# EAGLE schematic sandbox_v0.4 (EAGLE 6.3)

## Sheet 1 of 3
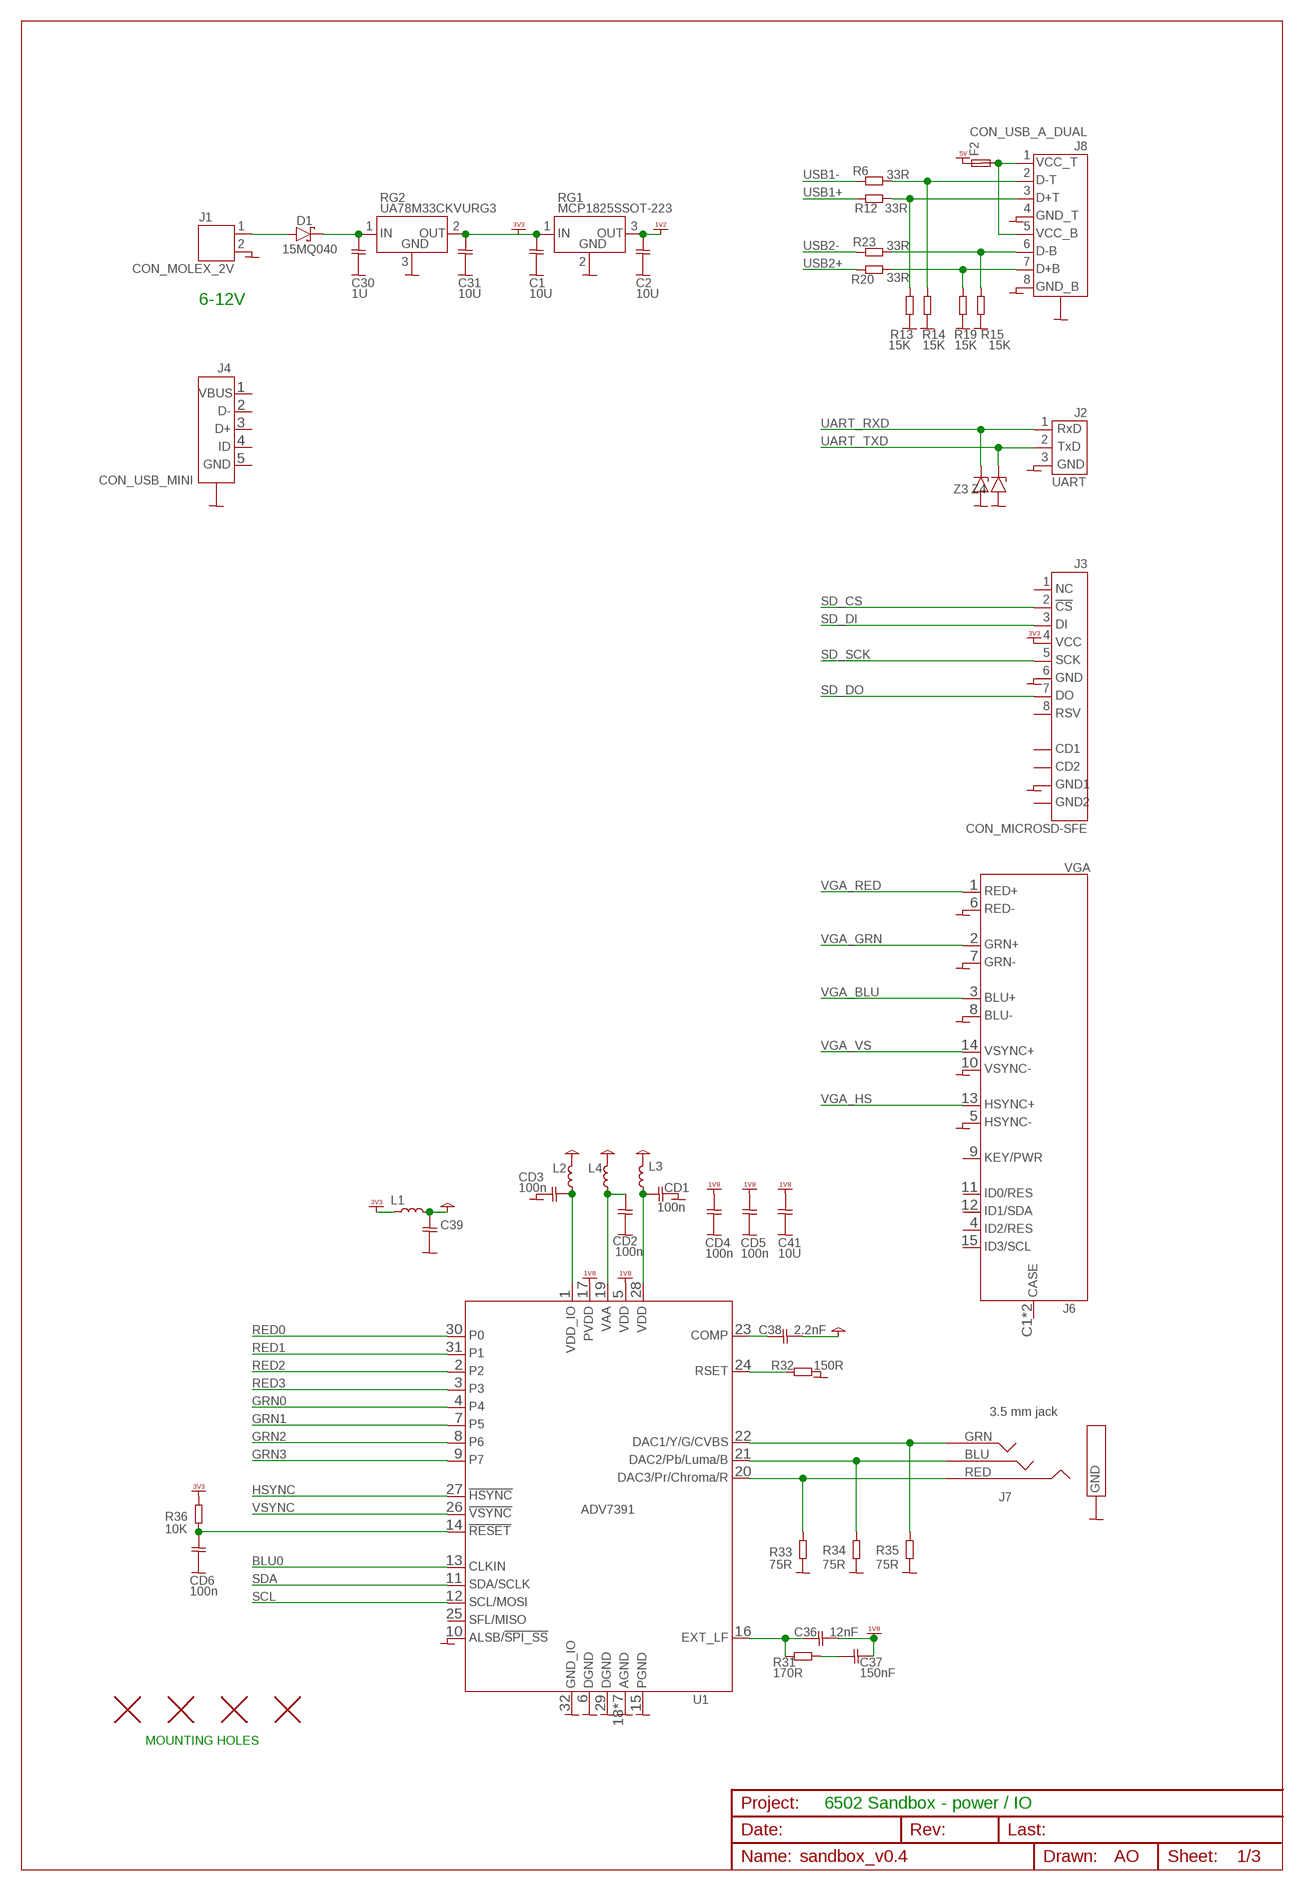
[diagram p0: schematic, sheet 1]

### Parts
C1  10U  CAP0603  [CAP0603]
C2  10U  CAP0603  [CAP0603]
C30  1U  CAP0603  [CAP0603]
C31  10U  CAP0603  [CAP0603]
C36  12nF  CAP0402-SMALL  [0402-SMALL]
C37  150nF  CAP0402-SMALL  [0402-SMALL]
C38  2.2nF  CAP0402-SMALL  [0402-SMALL]
C39  CAP0603  [CAP0603]
C41  10U  CAP0603  [CAP0603]
CD1  100n  CAP0402-SMALL  [0402-SMALL]
CD2  100n  CAP0402-SMALL  [0402-SMALL]
CD3  100n  CAP0402-SMALL  [0402-SMALL]
CD4  100n  CAP0402-SMALL  [0402-SMALL]
CD5  100n  CAP0402-SMALL  [0402-SMALL]
CD6  100n  CAP0402-SMALL  [0402-SMALL]
D1  15MQ040  DIODE_15MQ040  [DIODE_SMA]
F2  POLYFUSE1210  [POLYFUSE1210]
H1  HOLE_NPTH_3.2MM  [HOLE_NPTH_3.2MM]
H2  HOLE_NPTH_3.2MM  [HOLE_NPTH_3.2MM]
H3  HOLE_NPTH_3.2MM  [HOLE_NPTH_3.2MM]
H4  HOLE_NPTH_3.2MM  [HOLE_NPTH_3.2MM]
J1  CON_MOLEX_2V  [CON_MOLEX_2V]
J2  UART  CON_MOLEX_3V_RS232  [CON_MOLEX_3V]
J3  CON_MICROSD-SFE  [CON_USD-SOCKET-PP]
J4  CON_USB_MINI  [CON_USB-B_MINI]
J6  CON-VGA  [VGA]
J7  JACK_3.5MM_LUMBERG  [JACK_3.5MM_LUMBERG]
J8  CON_USB_A_DUAL  [USB_SOCKET_2XA]
L1  BEAD0603  [RES0603]
L2  BEAD0402-SMALL  [0402-SMALL]
L3  BEAD0402-SMALL  [0402-SMALL]
L4  BEAD0402-SMALL  [0402-SMALL]
R6  33R  RES0603  [RES0603]
R12  33R  RES0603  [RES0603]
R13  15K  RES0603  [RES0603]
R14  15K  RES0603  [RES0603]
R15  15K  RES0603  [RES0603]
R19  15K  RES0603  [RES0603]
R20  33R  RES0603  [RES0603]
R23  33R  RES0603  [RES0603]
R31  170R  RES0402-SMALL  [0402-SMALL]
R32  150R  RES0402-SMALL  [0402-SMALL]
R33  75R  RES0402-SMALL  [0402-SMALL]
R34  75R  RES0402-SMALL  [0402-SMALL]
R35  75R  RES0402-SMALL  [0402-SMALL]
R36  10K  RES0402-SMALL  [0402-SMALL]
RG1  MCP1825SSOT-223  [SOT-223]
RG2  UA78M33CKVURG3  [TO252]
U1  ADV7391  [CP_32_2]
Z3  ZENER_SOD80  [ZENER_SOD80]
Z4  ZENER_SOD80  [ZENER_SOD80]

### Nets
BLU0: U1.13(CLKIN) ; also sheet 3
BLUE: J7.3(BLU) R34.2 U1.21(DAC2/PB/LUMA/B)
GND: C1.2 C2.2 C30.2 C31.2 C39.2 C41.2 CD1.2 CD2.2 CD3.2 CD4.2 CD5.2 CD6.2 J1.2 J2.3 J3.6(6GND) J3.GND1(SHIELD) J4.CASE1(CASE) J4.CASE2(CASE) J4.CASE3(CASE) J4.CASE4(CASE) J6.5(HSYNC-) J6.6(RED-) J6.7(GRN-) J6.8(BLU-) J6.10(VSYNC-) J7.1(GND) J8.P4A(8.GND_B) J8.P4B(4.GND_T) J8.PC1(5.CASE) J8.PC2(5.CASE) J8.PC3(5.CASE) J8.PC4(5.CASE) R13.1 R14.1 R15.1 R19.1 R32.2 R33.1 R34.1 R35.1 RG1.2(2.GND) RG1.4(2.GND) RG2.3(3.GND) U1.6(DGND) U1.10(ALSB/!SPI_SS) U1.15(PGND) U1.18(AGND) U1.29(DGND) U1.32(GND_IO) U1.33(AGND) U1.34(AGND) U1.35(AGND) U1.36(AGND) U1.37(AGND) U1.38(AGND) Z3.1(+) Z4.1(+) ; also sheet 2,3
GREEN: J7.4A(GRN) J7.4B(GRN) R35.2 U1.22(DAC1/Y/G/CVBS)
GRN0: U1.4 ; also sheet 3
GRN1: U1.7(P5) ; also sheet 3
GRN2: U1.8(P6) ; also sheet 3
GRN3: U1.9(P7) ; also sheet 3
HSYNC: U1.27(!HSYNC) ; also sheet 3
N$1: C36.1 R31.1 U1.16(EXT_LF)
N$2: D1.A(+) J1.1
N$3: C30.1 D1.C(-) RG2.1(1.IN)
N$9: J8.P2B(2.D-T) R6.2 R14.2
N$10: C37.1 R31.2
N$11: C38.1 U1.23(COMP)
N$12: R32.1 U1.24(RSET)
N$13: CD2.1 L4.2 U1.19(VAA)
N$14: CD6.1 R36.1 U1.14(!RESET)
N$16: CD1.1 L3.2 U1.28(VDD)
N$17: CD3.1 L2.2 U1.1(VDD_IO)
N$42: J8.P3B(3.D+T) R12.2 R13.2
N$45: F2.2 J8.P1A(5.VCC_B) J8.P1B(1.VCC_T)
N$46: J8.P2A(6.D-B) R15.2 R23.2
N$48: J8.P3A(7.D+B) R19.2 R20.2
RED: J7.2(RED) R33.2 U1.20(DAC3/PR/CHROMA/R)
RED0: U1.30(P0) ; also sheet 3
RED1: U1.31(P1) ; also sheet 3
RED2: U1.2 ; also sheet 3
RED3: U1.3 ; also sheet 3
SCL: U1.12(SCL/MOSI)
SD_CS: J3.2(2CS)
SD_DI: J3.3(3DI)
SD_DO: J3.7(7DO)
SD_SCK: J3.5(5SCK)
SDA: U1.11(SDA/SCLK)
UART_RXD: J2.1 Z3.2(-)
UART_TXD: J2.2 Z4.2(-)
USB1+: R12.1
USB1-: R6.1
USB2+: R20.1
USB2-: R23.1
VCC: C38.2 C39.1 L1.1 L2.1 L3.1 L4.1
VDD_1V2: C2.1 RG1.3(3.OUT) ; supply symbol labelled VCC_1V2 ; also sheet 3
VDD_1V8: C36.2 C37.2 C41.1 CD4.1 CD5.1 U1.5(VDD) U1.17(PVDD) ; supply symbol labelled VCC_1V8
VDD_3V3: C1.1 C31.1 J3.4(4VCC) L1.2 R36.2 RG1.1(1.IN) RG2.2(2.OUT) ; supply symbol labelled VCC_3V3 ; also sheet 2,3
VDD_5V: F2.1 ; supply symbol labelled VCC_5V
VGA_BLU: J6.3(BLU+) ; also sheet 3
VGA_GRN: J6.2(GRN+) ; also sheet 3
VGA_HS: J6.13(HSYNC+) ; also sheet 3
VGA_RED: J6.1(RED+) ; also sheet 3
VGA_VS: J6.14(VSYNC+) ; also sheet 3
VSYNC: U1.26(!VSYNC) ; also sheet 3
Unconnected: J3.1(1NC) J3.8(8RSV) J3.CD1(SHIELD) J3.CD2(SHIELD) J3.GND2(SHIELD) J4.1(1.VBUS) J4.2(2.D-) J4.3(3.D+) J4.4(4.ID) J4.5(5.GND) J6.4(ID2/RES) J6.9(KEY/PWR) J6.11(ID0/RES) J6.12(ID1/SDA) J6.15(ID3/SCL) J6.C1(CASE) J6.C2(CASE) U1.25(SFL/MISO)

### Notes on the sheet
- 6-12V
- MOUNTING HOLES
- 6502 Sandbox - power / IO

## Sheet 2 of 3
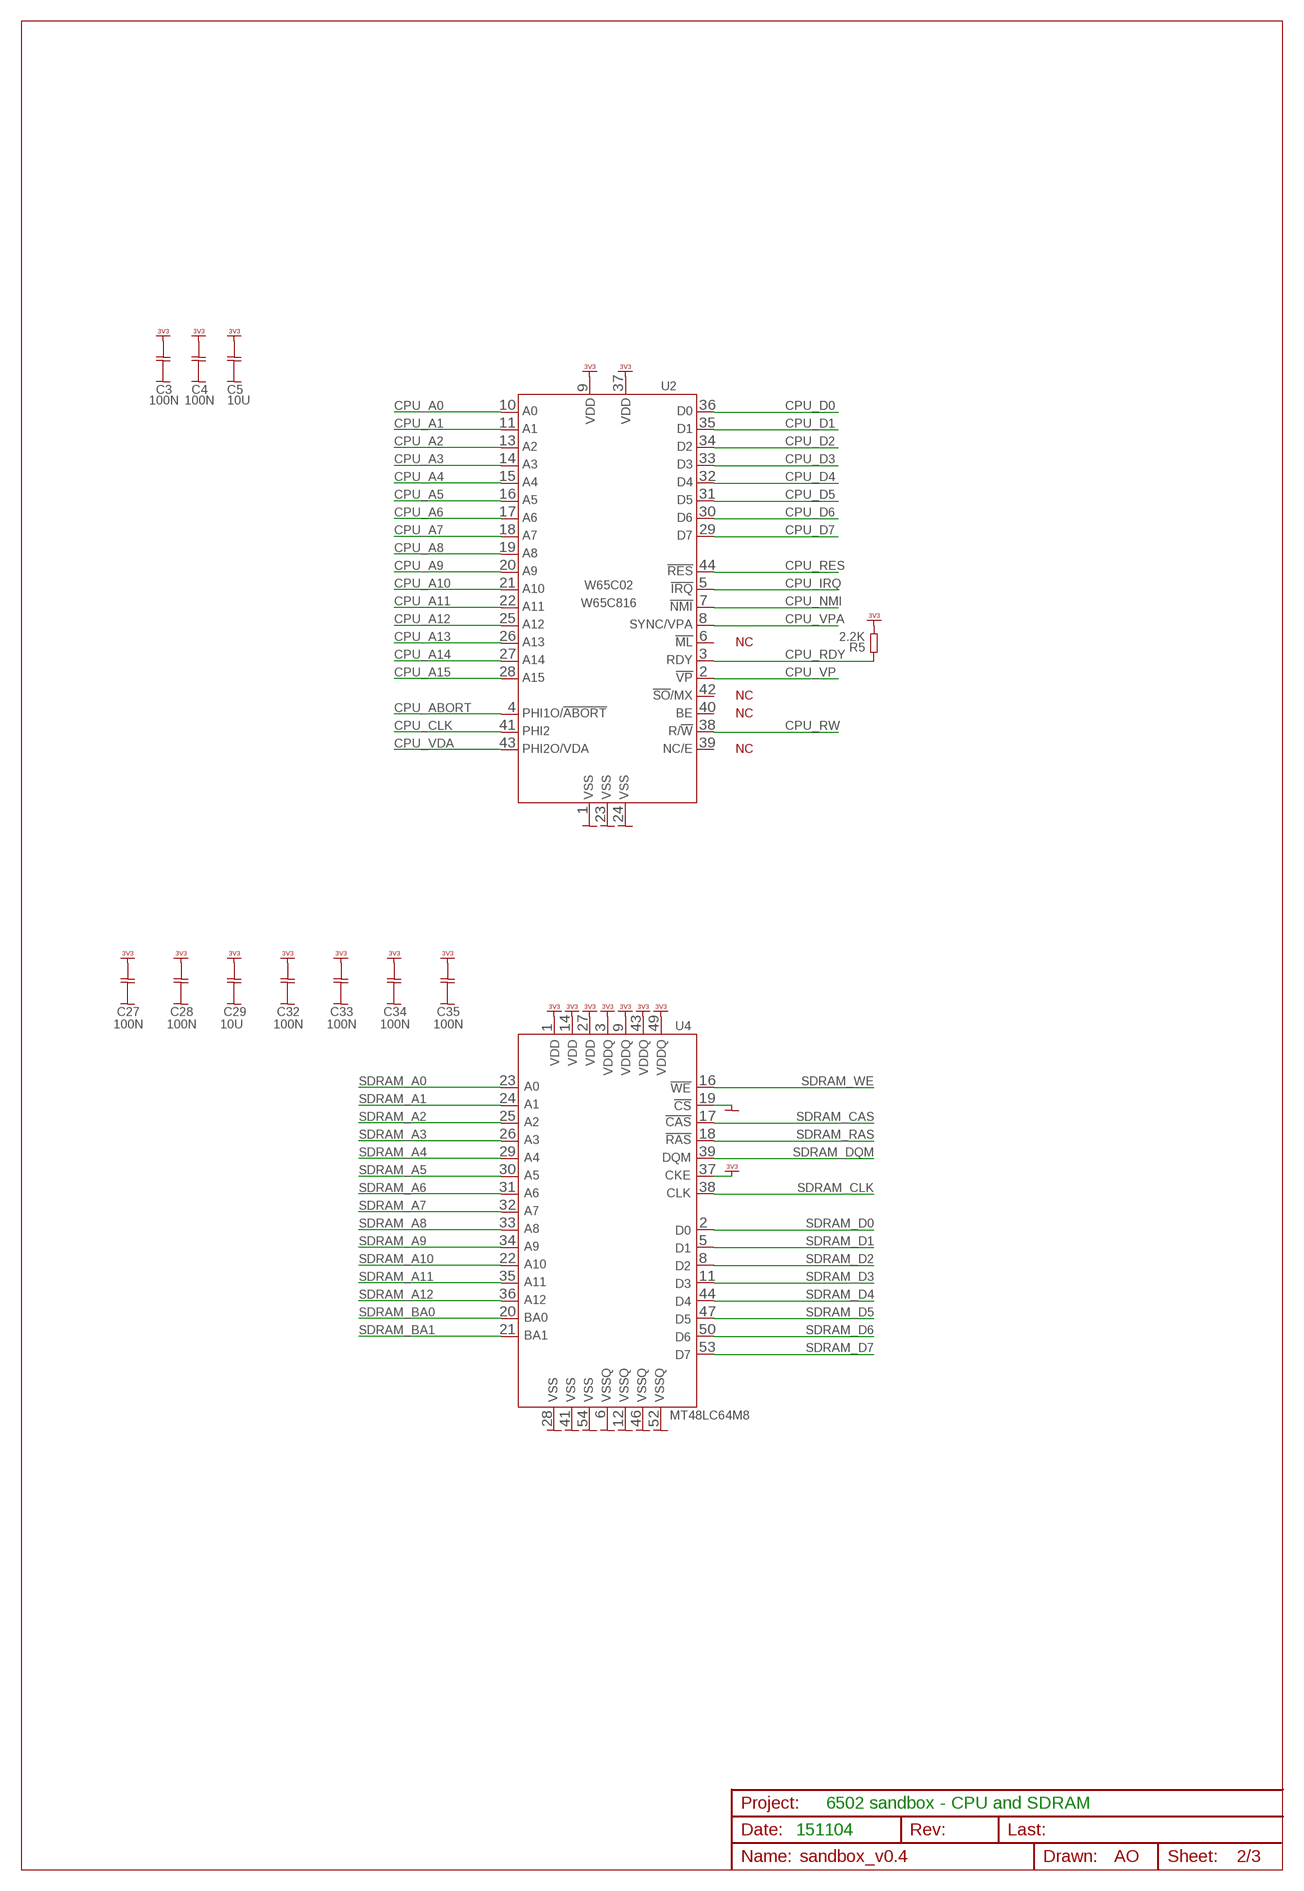
[diagram p1: schematic, sheet 2]

### Parts
C3  100N  CAP0402-SMALL  [0402-SMALL]
C4  100N  CAP0402-SMALL  [0402-SMALL]
C5  10U  CAP0603  [CAP0603]
C27  100N  CAP0402-SMALL  [0402-SMALL]
C28  100N  CAP0402-SMALL  [0402-SMALL]
C29  10U  CAP0402-SMALL  [0402-SMALL]
C32  100N  CAP0402-SMALL  [0402-SMALL]
C33  100N  CAP0603  [CAP0603]
C34  100N  CAP0402-SMALL  [0402-SMALL]
C35  100N  CAP0402-SMALL  [0402-SMALL]
R5  2.2K  RES0402-SMALL  [0402-SMALL]
U2  65C02/65C816  W65C02S44PLCC-SOCKET  [PLCC44]
U4  MT48LC64M8  [TSOP54-400]

### Nets
CPU_A0: U2.10(10A0) ; also sheet 3
CPU_A1: U2.11(11A1) ; also sheet 3
CPU_A2: U2.13(13A2) ; also sheet 3
CPU_A3: U2.14(14A3) ; also sheet 3
CPU_A4: U2.15(15A4) ; also sheet 3
CPU_A5: U2.16(16A5) ; also sheet 3
CPU_A6: U2.17(17A6) ; also sheet 3
CPU_A7: U2.18(18A7) ; also sheet 3
CPU_A8: U2.19(19A8) ; also sheet 3
CPU_A9: U2.20(20A9) ; also sheet 3
CPU_A10: U2.21(21A10) ; also sheet 3
CPU_A11: U2.22(22A11) ; also sheet 3
CPU_A12: U2.25(25A12) ; also sheet 3
CPU_A13: U2.26(26A13) ; also sheet 3
CPU_A14: U2.27(27A14) ; also sheet 3
CPU_A15: U2.28(28A15) ; also sheet 3
CPU_ABORT: U2.4(4PHI1O) ; also sheet 3
CPU_CLK: U2.41(41PHI2) ; also sheet 3
CPU_D0: U2.36(36D0) ; also sheet 3
CPU_D1: U2.35(35D1) ; also sheet 3
CPU_D2: U2.34(34D2) ; also sheet 3
CPU_D3: U2.33(33D3) ; also sheet 3
CPU_D4: U2.32(32D4) ; also sheet 3
CPU_D5: U2.31(31D5) ; also sheet 3
CPU_D6: U2.30(30D6) ; also sheet 3
CPU_D7: U2.29(29D7) ; also sheet 3
CPU_IRQ: U2.5(5IRQB) ; also sheet 3
CPU_NMI: U2.7(7NMIB) ; also sheet 3
CPU_RDY: R5.1 U2.3(3RDY) ; also sheet 3
CPU_RES: U2.44(44RESB) ; also sheet 3
CPU_RW: U2.38(38RWB) ; also sheet 3
CPU_VDA: U2.43(43PHI2O) ; also sheet 3
CPU_VP: U2.2(2VPB) ; also sheet 3
CPU_VPA: U2.8(8SYNC) ; also sheet 3
GND: C3.2 C4.2 C5.2 C27.2 C28.2 C29.2 C32.2 C33.2 C34.2 C35.2 U2.1 U2.23 U2.24 U4.6(VSSQ) U4.12(VSSQ) U4.19(\CS) U4.28(VSS) U4.41(VSS) U4.46(VSSQ) U4.52(VSSQ) U4.54(VSS) ; also sheet 1,3
SDRAM_A0: U4.23(A0) ; also sheet 3
SDRAM_A1: U4.24(A1) ; also sheet 3
SDRAM_A2: U4.25(A2) ; also sheet 3
SDRAM_A3: U4.26(A3) ; also sheet 3
SDRAM_A4: U4.29(A4) ; also sheet 3
SDRAM_A5: U4.30(A5) ; also sheet 3
SDRAM_A6: U4.31(A6) ; also sheet 3
SDRAM_A7: U4.32(A7) ; also sheet 3
SDRAM_A8: U4.33(A8) ; also sheet 3
SDRAM_A9: U4.34(A9) ; also sheet 3
SDRAM_A10: U4.22(A10) ; also sheet 3
SDRAM_A11: U4.35(A11) ; also sheet 3
SDRAM_A12: U4.36(A12) ; also sheet 3
SDRAM_BA0: U4.20(BA0) ; also sheet 3
SDRAM_BA1: U4.21(BA1) ; also sheet 3
SDRAM_CAS: U4.17(!CAS) ; also sheet 3
SDRAM_CLK: U4.38(CLK) ; also sheet 3
SDRAM_D0: U4.2(DQ0) ; also sheet 3
SDRAM_D1: U4.5(DQ1) ; also sheet 3
SDRAM_D2: U4.8(DQ2) ; also sheet 3
SDRAM_D3: U4.11(DQ3) ; also sheet 3
SDRAM_D4: U4.44(DQ4) ; also sheet 3
SDRAM_D5: U4.47(DQ5) ; also sheet 3
SDRAM_D6: U4.50(DQ6) ; also sheet 3
SDRAM_D7: U4.53(DQ7) ; also sheet 3
SDRAM_DQM: U4.39(DQML) ; also sheet 3
SDRAM_RAS: U4.18(!RAS) ; also sheet 3
SDRAM_WE: U4.16(!WE) ; also sheet 3
VDD_3V3: C3.1 C4.1 C5.1 C27.1 C28.1 C29.1 C32.1 C33.1 C34.1 C35.1 R5.2 U2.9 U2.37 U4.1(VDD) U4.3(VDDQ) U4.9(VDDQ) U4.14(VDD) U4.27(VDD) U4.37(CKE) U4.43(VDDQ) U4.49(VDDQ) ; supply symbol labelled VCC_3V3 ; also sheet 1,3
Unconnected: U2.6(6MLB) U2.39(39NC) U2.40(40BE) U2.42(42SOB)

### Notes on the sheet
- NC
- NC
- NC
- NC
- 6502 sandbox - CPU and SDRAM
- 151104

## Sheet 3 of 3
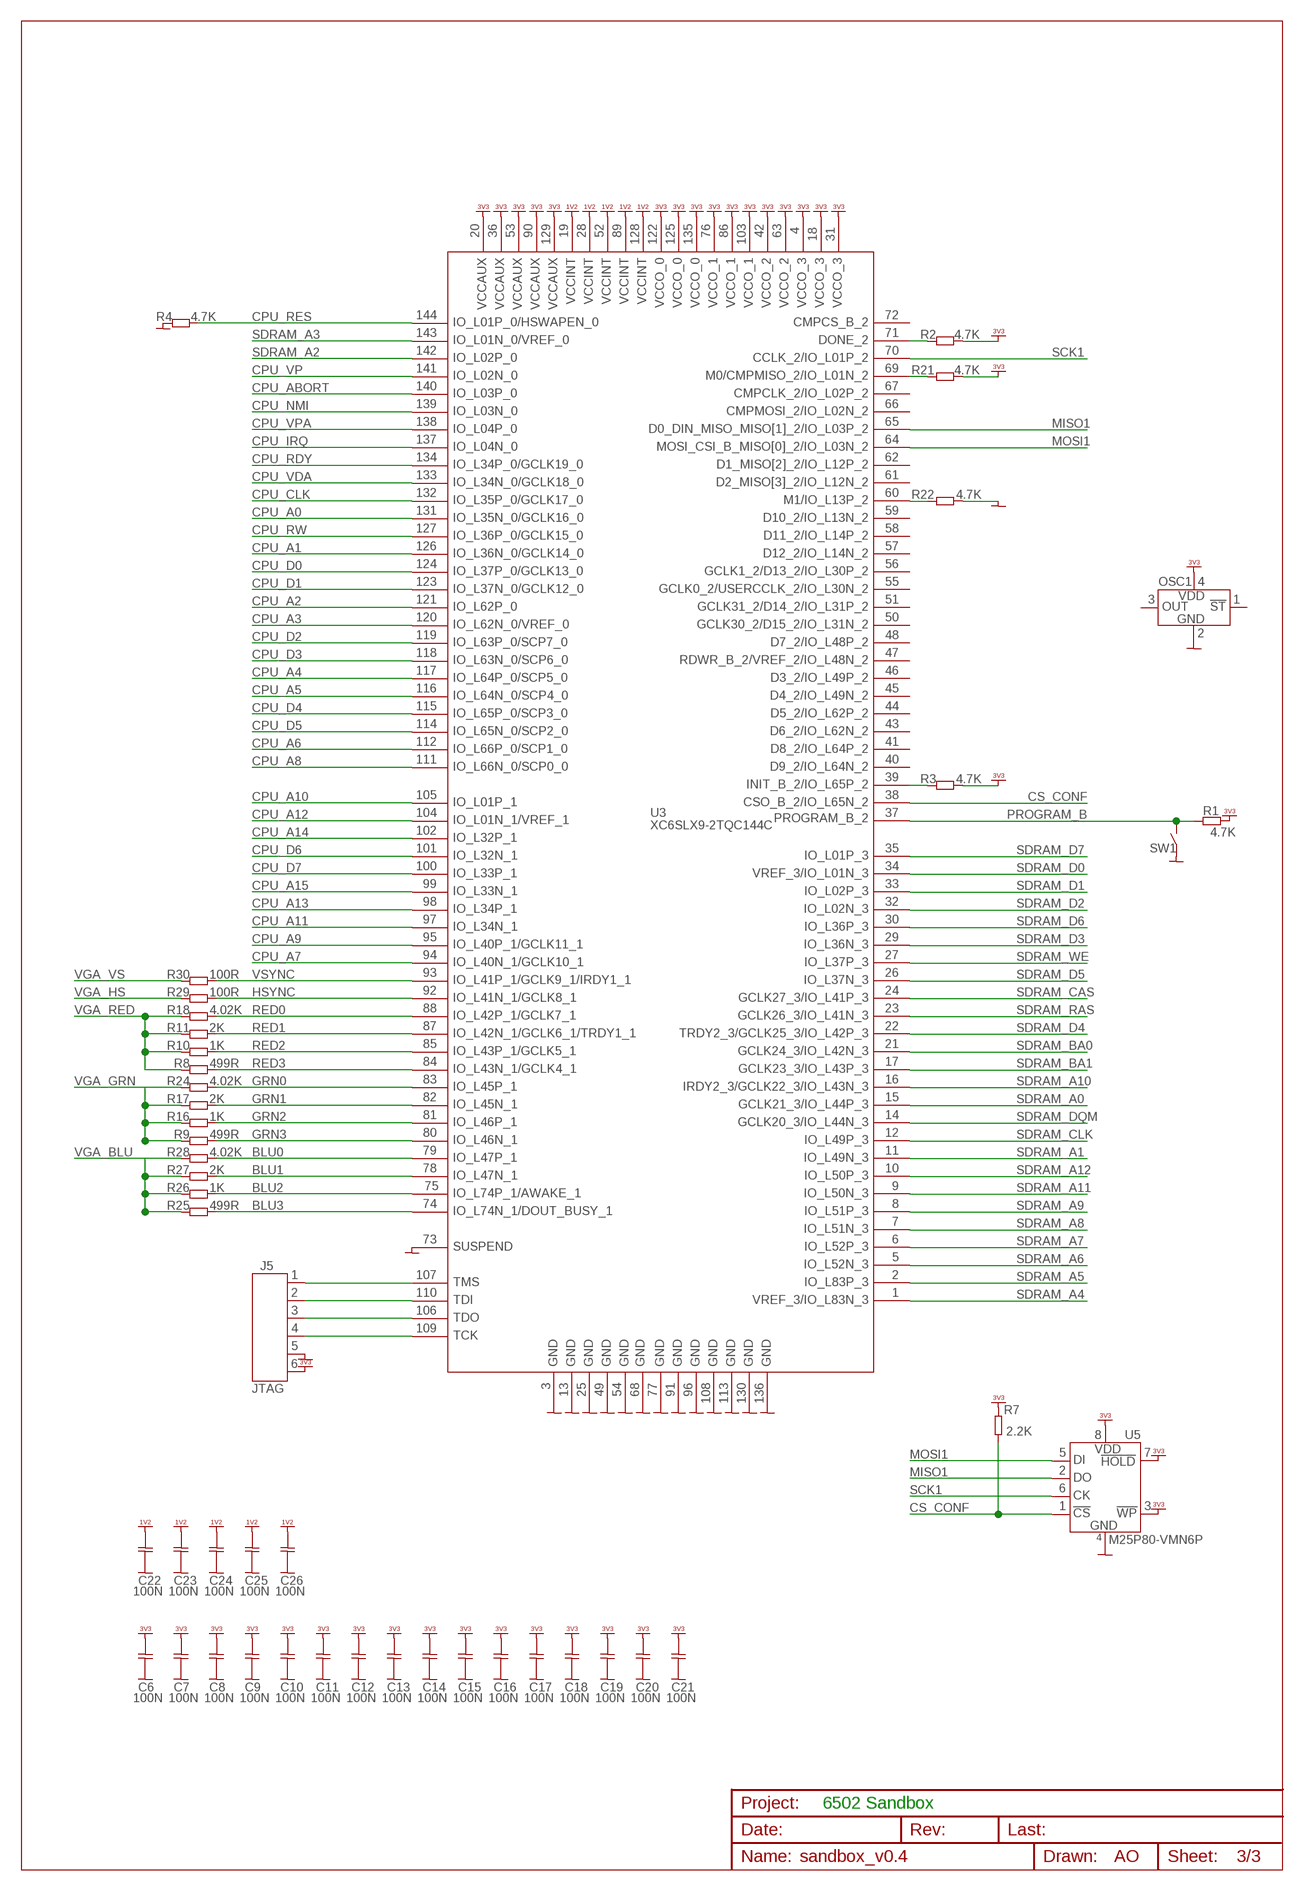
[diagram p2: schematic, sheet 3]

### Parts
C6  100N  CAP0402-SMALL  [0402-SMALL]
C7  100N  CAP0402-SMALL  [0402-SMALL]
C8  100N  CAP0402-SMALL  [0402-SMALL]
C9  100N  CAP0402-SMALL  [0402-SMALL]
C10  100N  CAP0402-SMALL  [0402-SMALL]
C11  100N  CAP0402-SMALL  [0402-SMALL]
C12  100N  CAP0402-SMALL  [0402-SMALL]
C13  100N  CAP0402-SMALL  [0402-SMALL]
C14  100N  CAP0402-SMALL  [0402-SMALL]
C15  100N  CAP0402-SMALL  [0402-SMALL]
C16  100N  CAP0402-SMALL  [0402-SMALL]
C17  100N  CAP0402-SMALL  [0402-SMALL]
C18  100N  CAP0402-SMALL  [0402-SMALL]
C19  100N  CAP0402-SMALL  [0402-SMALL]
C20  100N  CAP0402-SMALL  [0402-SMALL]
C21  100N  CAP0402-SMALL  [0402-SMALL]
C22  100N  CAP0402-SMALL  [0402-SMALL]
C23  100N  CAP0402-SMALL  [0402-SMALL]
C24  100N  CAP0402-SMALL  [0402-SMALL]
C25  100N  CAP0402-SMALL  [0402-SMALL]
C26  100N  CAP0402-SMALL  [0402-SMALL]
J5  JTAG  GOLD6X1  [GOLD6X1]
OSC1  OSC_2.5X3.2  [OSC_2.5X3.2]
R1  4.7K  RES0603  [RES0603]
R2  4.7K  RES0603  [RES0603]
R3  4.7K  RES0603  [RES0603]
R4  4.7K  RES0603  [RES0603]
R7  2.2K  RES0603  [RES0603]
R8  499R  RES0402-SMALL  [0402-SMALL]
R9  499R  RES0402-SMALL  [0402-SMALL]
R10  1K  RES0402-SMALL  [0402-SMALL]
R11  2K  RES0402-SMALL  [0402-SMALL]
R16  1K  RES0402-SMALL  [0402-SMALL]
R17  2K  RES0402-SMALL  [0402-SMALL]
R18  4.02K  RES0402-SMALL  [0402-SMALL]
R21  4.7K  RES0603  [RES0603]
R22  4.7K  RES0603  [RES0603]
R24  4.02K  RES0402-SMALL  [0402-SMALL]
R25  499R  RES0402-SMALL  [0402-SMALL]
R26  1K  RES0402-SMALL  [0402-SMALL]
R27  2K  RES0402-SMALL  [0402-SMALL]
R28  4.02K  RES0402-SMALL  [0402-SMALL]
R29  100R  RES0402-SMALL  [0402-SMALL]
R30  100R  RES0402-SMALL  [0402-SMALL]
SW1  SWITCH_PUSHBUTTON  [SWITCH_SMD_PBUTTON_2P]
U3  XC6SLX9-2TQC144C  [TQ144]
U5  M25P80-VMN6P  [SO8]

### Nets
BLU0: R28.2 U3.P79 ; also sheet 1
BLU1: R27.2 U3.P78
BLU2: R26.2 U3.P75
BLU3: R25.2 U3.P74
CPU_A0: U3.P131 ; also sheet 2
CPU_A1: U3.P126 ; also sheet 2
CPU_A2: U3.P121 ; also sheet 2
CPU_A3: U3.P120 ; also sheet 2
CPU_A4: U3.P117 ; also sheet 2
CPU_A5: U3.P116 ; also sheet 2
CPU_A6: U3.P112 ; also sheet 2
CPU_A7: U3.P94 ; also sheet 2
CPU_A8: U3.P111 ; also sheet 2
CPU_A9: U3.P95 ; also sheet 2
CPU_A10: U3.P105 ; also sheet 2
CPU_A11: U3.P97 ; also sheet 2
CPU_A12: U3.P104 ; also sheet 2
CPU_A13: U3.P98 ; also sheet 2
CPU_A14: U3.P102 ; also sheet 2
CPU_A15: U3.P99 ; also sheet 2
CPU_ABORT: U3.P140 ; also sheet 2
CPU_CLK: U3.P132 ; also sheet 2
CPU_D0: U3.P124 ; also sheet 2
CPU_D1: U3.P123 ; also sheet 2
CPU_D2: U3.P119 ; also sheet 2
CPU_D3: U3.P118 ; also sheet 2
CPU_D4: U3.P115 ; also sheet 2
CPU_D5: U3.P114 ; also sheet 2
CPU_D6: U3.P101 ; also sheet 2
CPU_D7: U3.P100 ; also sheet 2
CPU_IRQ: U3.P137 ; also sheet 2
CPU_NMI: U3.P139 ; also sheet 2
CPU_RDY: U3.P134 ; also sheet 2
CPU_RES: R4.1 U3.P144 ; also sheet 2
CPU_RW: U3.P127 ; also sheet 2
CPU_VDA: U3.P133 ; also sheet 2
CPU_VP: U3.P141 ; also sheet 2
CPU_VPA: U3.P138 ; also sheet 2
CS_CONF: R7.1 U3.P38 U5.1(1.!S)
DONE: R2.2 U3.P71
GND: C6.2 C7.2 C8.2 C9.2 C10.2 C11.2 C12.2 C13.2 C14.2 C15.2 C16.2 C17.2 C18.2 C19.2 C20.2 C21.2 C22.2 C23.2 C24.2 C25.2 C26.2 J5.5 OSC1.2 R4.2 R22.1 SW1.2(3-4) U3.P3 U3.P13 U3.P25 U3.P49 U3.P54 U3.P68 U3.P73 U3.P77 U3.P91 U3.P96 U3.P108 U3.P113 U3.P130 U3.P136 U5.4(4.GND) ; also sheet 1,2
GRN0: R24.2 U3.P83 ; also sheet 1
GRN1: R17.2 U3.P82 ; also sheet 1
GRN2: R16.2 U3.P81 ; also sheet 1
GRN3: R9.2 U3.P80 ; also sheet 1
HSYNC: R29.2 U3.P92 ; also sheet 1
MISO1: U3.P65 U5.2(2.Q)
MOSI1: U3.P64 U5.5(5.D)
N$4: R3.2 U3.P39
N$5: J5.1 U3.P107
N$6: J5.2 U3.P110
N$7: J5.3 U3.P106
N$8: J5.4 U3.P109
N$54: R22.2 U3.P60
N$55: R21.2 U3.P69
PROGRAM_B: R1.2 SW1.1(1-2) U3.P37
RED0: R18.2 U3.P88 ; also sheet 1
RED1: R11.2 U3.P87 ; also sheet 1
RED2: R10.2 U3.P85 ; also sheet 1
RED3: R8.2 U3.P84 ; also sheet 1
SCK1: U3.P70 U5.6(6.C)
SDRAM_A0: U3.P15 ; also sheet 2
SDRAM_A1: U3.P11 ; also sheet 2
SDRAM_A2: U3.P142 ; also sheet 2
SDRAM_A3: U3.P143 ; also sheet 2
SDRAM_A4: U3.P1 ; also sheet 2
SDRAM_A5: U3.P2 ; also sheet 2
SDRAM_A6: U3.P5 ; also sheet 2
SDRAM_A7: U3.P6 ; also sheet 2
SDRAM_A8: U3.P7 ; also sheet 2
SDRAM_A9: U3.P8 ; also sheet 2
SDRAM_A10: U3.P16 ; also sheet 2
SDRAM_A11: U3.P9 ; also sheet 2
SDRAM_A12: U3.P10 ; also sheet 2
SDRAM_BA0: U3.P21 ; also sheet 2
SDRAM_BA1: U3.P17 ; also sheet 2
SDRAM_CAS: U3.P24 ; also sheet 2
SDRAM_CLK: U3.P12 ; also sheet 2
SDRAM_D0: U3.P34 ; also sheet 2
SDRAM_D1: U3.P33 ; also sheet 2
SDRAM_D2: U3.P32 ; also sheet 2
SDRAM_D3: U3.P29 ; also sheet 2
SDRAM_D4: U3.P22 ; also sheet 2
SDRAM_D5: U3.P26 ; also sheet 2
SDRAM_D6: U3.P30 ; also sheet 2
SDRAM_D7: U3.P35 ; also sheet 2
SDRAM_DQM: U3.P14 ; also sheet 2
SDRAM_RAS: U3.P23 ; also sheet 2
SDRAM_WE: U3.P27 ; also sheet 2
VDD_1V2: C22.1 C23.1 C24.1 C25.1 C26.1 U3.P19 U3.P28 U3.P52 U3.P89 U3.P128 ; supply symbol labelled VCC_1V2 ; also sheet 1
VDD_3V3: C6.1 C7.1 C8.1 C9.1 C10.1 C11.1 C12.1 C13.1 C14.1 C15.1 C16.1 C17.1 C18.1 C19.1 C20.1 C21.1 J5.6 OSC1.4 R1.1 R2.1 R3.1 R7.2 R21.1 U3.P4 U3.P18 U3.P20 U3.P31 U3.P36 U3.P42 U3.P53 U3.P63 U3.P76 U3.P86 U3.P90 U3.P103 U3.P122 U3.P125 U3.P129 U3.P135 U5.3(3.!W) U5.7(7.!HOLD) U5.8(8.VDD) ; supply symbol labelled VCC_3V3 ; also sheet 1,2
VGA_BLU: R25.1 R26.1 R27.1 R28.1 ; also sheet 1
VGA_GRN: R9.1 R16.1 R17.1 R24.1 ; also sheet 1
VGA_HS: R29.1 ; also sheet 1
VGA_RED: R8.1 R10.1 R11.1 R18.1 ; also sheet 1
VGA_VS: R30.1 ; also sheet 1
VSYNC: R30.2 U3.P93 ; also sheet 1
Unconnected: OSC1.1 OSC1.3 U3.P40 U3.P41 U3.P43 U3.P44 U3.P45 U3.P46 U3.P47 U3.P48 U3.P50 U3.P51 U3.P55 U3.P56 U3.P57 U3.P58 U3.P59 U3.P61 U3.P62 U3.P66 U3.P67 U3.P72

### Notes on the sheet
- 6502 Sandbox

## Library data of the parts
C1 C2 C5 C30 C31 C33 C39 C41 = 00-own_parts:CAP0603
C3 C4 C6-C29 C32 C34-C38 CD1-CD6 = c-scape:CAP: Capacitor, ceramic, 2010
D1 = 00-own_parts:DIODE_15MQ040: Diode, Schottky, 15MQ040, 40V/3A, SMA, F# 165-1114
F2 = 00-own_parts:POLYFUSE1210
H1-H4 = 00-own_parts:HOLE_NPTH_3.2MM: Hole, NPTH, 3.2mm
J1 = 00-own_parts:CON_MOLEX_2V: Connector, Molex, header, straight, 0.1", 2p, F#973-1601
J2 = 00-own_parts:CON_MOLEX_3V_RS232: Connector, Molex, header, straight, 0.1", 4p, F#973-1156
J3 = 00-own_parts:CON_MICROSD: Connector, micro SD Card, Kyocera, Series 5138, F#:1558178, sku: PRT-09545
J4 = c-scape:CON_USB_MINI
J5 = 00-own_parts:GOLD6X1
J6 = c-scape:CON-VGA
J7 = c-scape:JACK_3.5MM_LUMBERG
J8 = c-scape:CON_USB_A_DUAL: Connector, USB A, PCB, SMD, F#131-4363
L1-L4 = c-scape:BEAD
OSC1 = 00-own_parts:OSC_2.5X3.2: SG-310 SCF C 25.0MHZ, 2.5x3.2mm, F#127-8067
R1-R4 R6 R7 R12-R15 R19-R23 = 00-own_parts:RES0603
R5 R8-R11 R16-R18 R24-R36 = c-scape:RES
RG1 = c-scape:MCP1825S: Regulator, 1.2V, 500 mA, LDO, F#185-1989
RG2 = 00-own_parts:UA78M33CKVURG3: Regulator, 500mA, Vdrop: 2V, Vin_max: 25V, Vout: 3V3, TO252 (DPAK), DK# 296-21208-1-ND
SW1 = 00-own_parts:SWITCH_PUSHBUTTON: switch, push button, SPNO, MCTAEF, F# 160-5485
U1 = c-scape:ADV7391: Low Power, Chip Scale 10-Bit SD/HD Video Encoder
U2 = c-scape:W65C02S44
U3 = 00-own_parts:XC6SLX9-2TQC144C: FPGA, Spartan-6, 9.152 cells, 90K + 576K RAM, TQ144
U4 = c-scape:MT48LC64M8: 256Mb or 512 Mb SDRAM
U5 = 00-own_parts:M25P80-VMN6P: Memory, FLASH, 8Mbit (1Mb x 8), SPI, 75 Mc, SO8, F#173-4968
Z3 Z4 = 00-own_parts:ZENER_SOD80